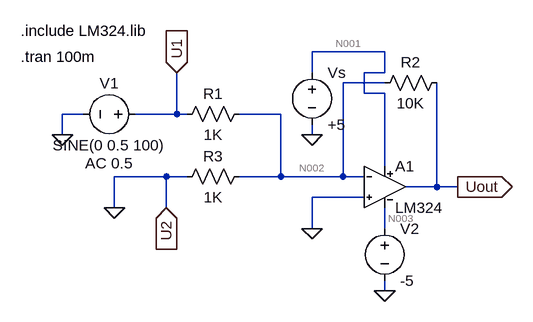
[diagram p0: schematic 2_1_c.asc]
2_1_c.asc, the LTspice schematic file:
Version 4.1
SHEET 1 1000 680
WIRE 320 -64 208 -64
WIRE 208 -32 208 -64
WIRE 320 -32 320 -64
WIRE 320 -32 288 -32
WIRE 320 -16 256 -16
WIRE 288 0 288 -32
WIRE 320 0 288 0
WIRE -144 32 -176 32
WIRE 0 32 0 -32
WIRE 0 32 -64 32
WIRE 16 32 0 32
WIRE 160 32 96 32
WIRE -176 64 -176 32
WIRE 208 64 208 48
WIRE 320 112 320 0
WIRE -16 128 -96 128
WIRE 16 128 -16 128
WIRE 160 128 160 32
WIRE 160 128 96 128
WIRE 256 128 256 -16
WIRE 256 128 160 128
WIRE 288 128 256 128
WIRE 400 144 400 -16
WIRE 400 144 352 144
WIRE 432 144 400 144
WIRE 288 160 208 160
WIRE -96 176 -96 128
WIRE -16 176 -16 128
WIRE 208 208 208 160
WIRE 320 208 320 176
WIRE 320 304 320 288
FLAG 208 64 0
FLAG 432 144 Uout
IOPIN 432 144 Out
FLAG 0 -32 U1
IOPIN 0 -32 In
FLAG -16 176 U2
IOPIN -16 176 In
FLAG -176 64 0
FLAG 208 208 0
FLAG -96 176 0
FLAG 320 304 0
SYMBOL LM324 320 144 R0
SYMATTR InstName A1
SYMBOL res 112 16 R90
WINDOW 0 0 56 VBottom 2
WINDOW 3 32 56 VTop 2
SYMATTR InstName R1
SYMATTR Value 1K
SYMATTR SpiceLine tol=1 pwr=0.1
SYMBOL res 416 -32 R90
WINDOW 0 0 56 VBottom 2
WINDOW 3 32 56 VTop 2
SYMATTR InstName R2
SYMATTR Value 10K
SYMATTR SpiceLine tol=1 pwr=0.1
SYMBOL voltage 208 -48 R0
WINDOW 123 0 0 Left 0
WINDOW 39 0 0 Left 0
SYMATTR InstName Vs
SYMATTR Value +5
SYMBOL res 112 112 R90
WINDOW 0 0 56 VBottom 2
WINDOW 3 32 56 VTop 2
SYMATTR InstName R3
SYMATTR Value 1K
SYMATTR SpiceLine tol=1 pwr=0.1
SYMBOL voltage -48 32 R90
WINDOW 0 -32 56 VBottom 2
WINDOW 3 32 56 VTop 2
WINDOW 123 60 56 VTop 2
WINDOW 39 0 0 Left 0
SYMATTR InstName V1
SYMATTR Value SINE(0 0.5 100)
SYMATTR Value2 AC 0.5
SYMBOL voltage 320 192 R0
WINDOW 123 0 0 Left 0
WINDOW 39 0 0 Left 0
SYMATTR InstName V2
SYMATTR Value -5
TEXT -240 -96 Left 2 !.include LM324.lib
TEXT -240 -56 Left 2 !.tran 100m

The netlist it stands for:
* 2_1_c.asc
X§A1 0 N002 N001 N003 Uout LM324  ; pins In+ In- V+ V- OUT
R1 N002 U1 1K tol=1 pwr=0.1
R2 Uout N002 10K tol=1 pwr=0.1
Vs N001 0 +5
R3 N002 0 1K tol=1 pwr=0.1
V1 U1 0 SINE(0 0.5 100) AC 0.5
V2 N003 0 -5
.include LM324.lib
.tran 100m
.backanno
.end

* Results of the author's LTspice run, read from the files saved beside the schematic
* Operating Point, zero values left out:
*   V(n001) = 5 V
*   V(uout) = -2.356 mV
*   V(n002) = -88.4 µV
*   V(n003) = -5 V
*   I(R2) = -226.8 nA
*   I(R3) = -88.4 nA
*   I(V1) = -88.4 nA
*   I(Vs) = -357.5 µA
*   I(R1) = -88.4 nA
*   I(V2) = 357.6 µA
*   Ix(a1:in+) = -48.56 nA
*   Ix(a1:in-) = -50 nA
*   Ix(a1:vcc) = 357.5 µA
*   Ix(a1:vss) = -357.6 µA
*   Ix(a1:out) = 226.8 nA
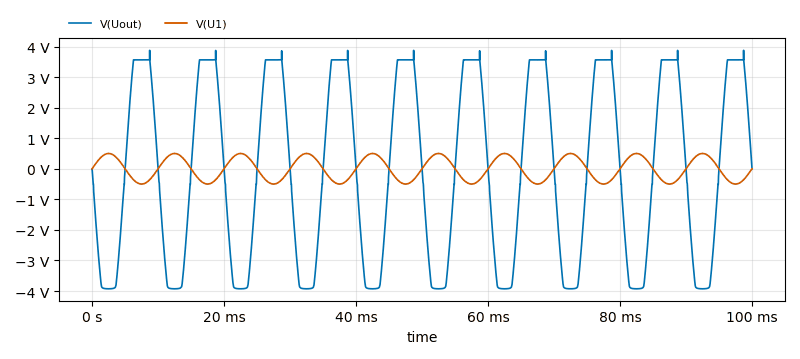
[diagram p1: Transient Analysis of 2_1_c.asc, plotted from the saved traces]
* Transient Analysis, 1 run:
*   V(Uout): min -3.928 V, max 3.874 V, average -81.5 mV, rms 3.038 V, last 6.009 mV
*   V(U1): min -500 mV, max 500 mV, average -6.578 µV, rms 353.6 mV, last 0 V